# Altium schematic sheet BLE.SchDoc
size A4; CompanyName: SPAN; Engineer: Goverdhan; Organization: University of Utah; Address1: 50 S Central Campus Dr; Address2: MEB Rm 3129; Address3: Salt Lake City, Utah 84115; Address4: USA; Revision: 1; SheetNumber: 3; SheetTotal: 5
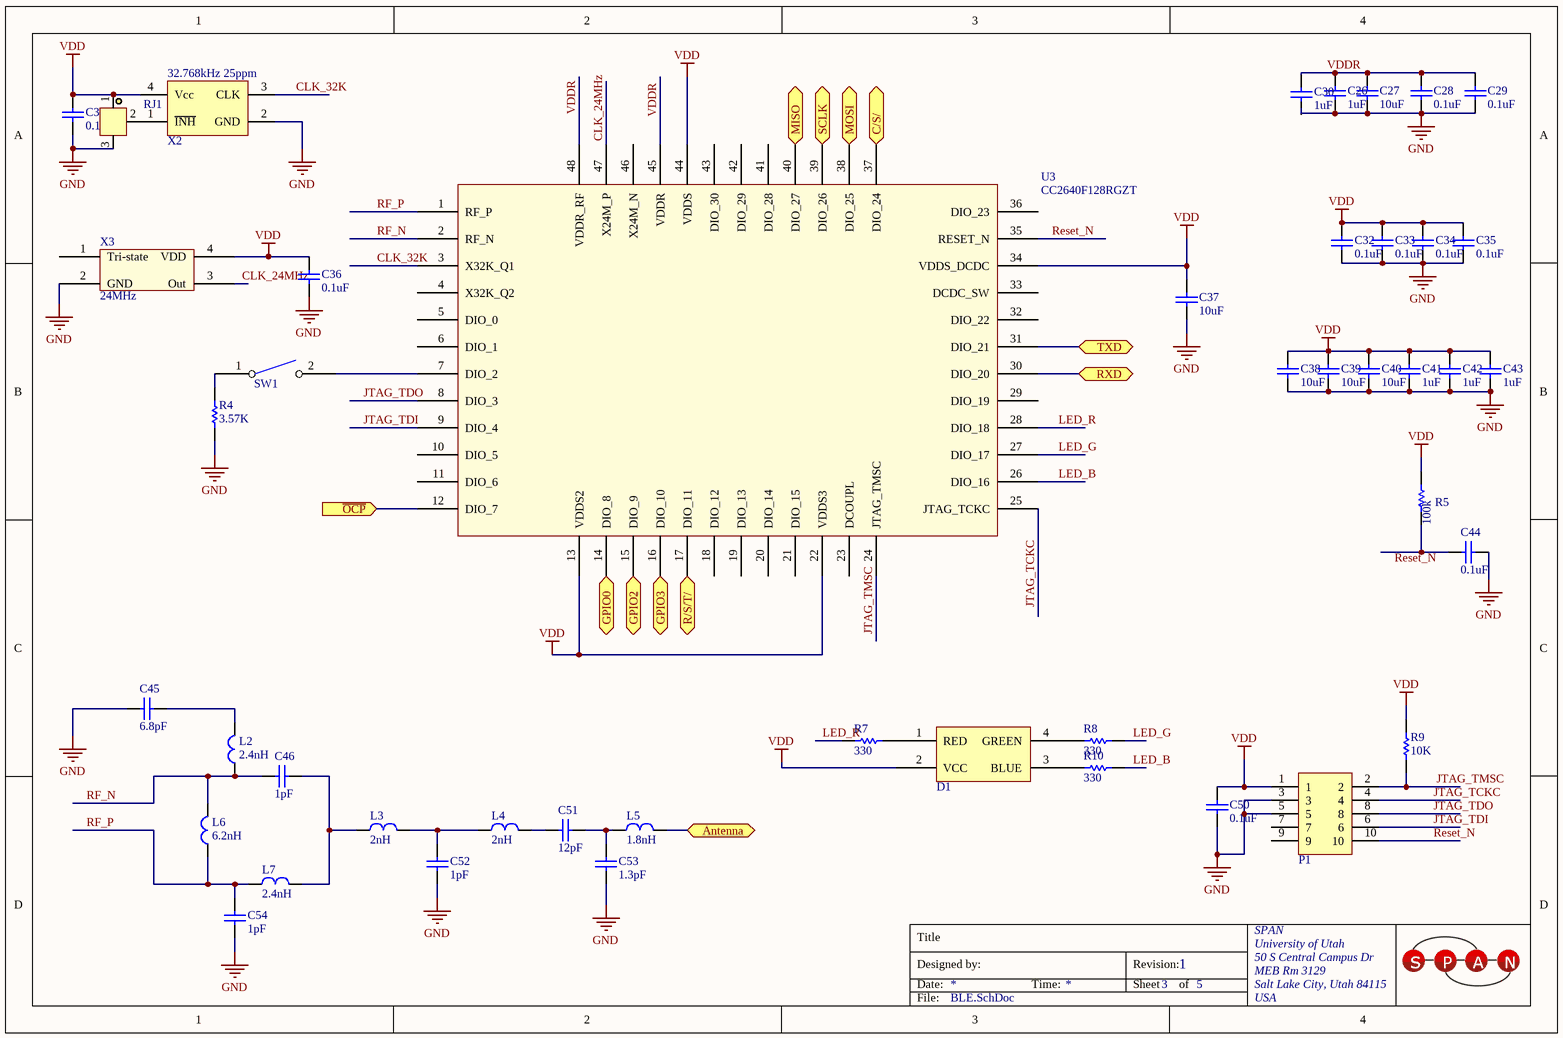
[diagram p0: BLE.SchDoc]

## Parts
C26  1uF  [0603_Cap]
C27  10uF  [0603_Cap]
C28  0.1uF  [0603_Cap]
C29  0.1uF  [0603_Cap]
C30  1uF  [0603_Cap]
C31  0.1uF  [0603_Cap]
C32  0.1uF  [0603_Cap]
C33  0.1uF  [0603_Cap]
C34  0.1uF  [0603_Cap]
C35  0.1uF  [0603_Cap]
C36  0.1uF  [0603_Cap]
C37  10uF  [0603_Cap]
C38  10uF  [0603_Cap]
C39  10uF  [0603_Cap]
C40  10uF  [0603_Cap]
C41  1uF  [0603_Cap]
C42  1uF  [0603_Cap]
C43  1uF  [0603_Cap]
C44  0.1uF  [0603_Cap]
C45  6.8pF  [0603_Cap]
C46  1pF  [0603_Cap]
C50  0.1uF  [0603_Cap]
C51  12pF  [0603_Cap]
C52  1pF  [0603_Cap]
C53  1.3pF  [0603_Cap]
C54  1pF  [0603_Cap]
D1  CLV1A-FKB-CJ1M1F1BB7R4S3  [CREE LV1]  (value not drawn)
L2  2.4nH  [0603_IND]
L3  2nH  [0603_IND]
L4  2nH  [0603_IND]
L5  1.8nH  [0603_IND]
L6  6.2nH  [0603_IND]
L7  2.4nH  [0603_IND]
P1  M50-3500542  [M50]  (value not drawn)
R4  3.57K  [0603_RES]
R5  MCR03ERTJ104  [RESC1608X06N (0603)]  (value not drawn)
R7  330  [0603_RES]
R8  330  [0603_RES]
R9  10K  [0603_RES]
R10  330  [0603_RES]
RJ1  R_J  [RJ]  (value not drawn)
SW1  EVQ-PE105K  [EVQ-PE105K]  (value not drawn)
U3  CC2640F128RGZT  [QFN_48_CC2640]
X2  KC2520B32K7680CM2E00  [2.5x2.0x0.7mmXTAL]  (value not drawn)
X3  24MHz  [XO_24_ASTX_H11]

## Ports
Antenna (bidir), C/S/, GPIO0, GPIO2, GPIO3, MISO, MOSI, R/S/T/, RXD, SCLK, TXD, ~{OCP} (in)

## Nets
GND: C26.1 C27.1 C28.1 C29.1 C31.1 C32.1 C33.1 C34.1 C35.1 C36.1 C37.1 C38.1 C39.1 C40.1 C41.1 C42.1 C43.1 C44.2 C45.1 C50.1 C52.1 C53.1 C54.1 P1.3 P1.5 R4.1 RJ1.3 X2.2(GND) X3.2(GND)
VDD: C31.2 C32.2 C33.2 C34.2 C35.2 C36.2 C37.2 C38.2 C39.2 C40.2 C41.2 C42.2 C43.2 C50.2 D1.2(VCC) P1.1 R5.2 R9.2 RJ1.1 U3.13(VDDS2) U3.22(VDDS3) U3.34(VDDS_DCDC) U3.44(VDDS) X2.4(Vcc) X3.4(VDD)
Antenna: L5.2 ; port Antenna
C/S/: U3.37(DIO_24) ; port C/S/
CLK_24MHz: U3.47(X24M_P) X3.3(Out)
CLK_32K: U3.3(X32K_Q1) X2.3(CLK)
GPIO0: U3.14(DIO_8) ; port GPIO0
GPIO2: U3.15(DIO_9) ; port GPIO2
GPIO3: U3.16(DIO_10) ; port GPIO3
JTAG_TCKC: P1.4 U3.25(JTAG_TCKC)
JTAG_TDI: P1.6 U3.9(DIO_4)
JTAG_TDO: P1.8 U3.8(DIO_3)
JTAG_TMSC: P1.2 R9.1 U3.24(JTAG_TMSC)
LED_B: R10.2 U3.26(DIO_16)
LED_G: R8.2 U3.27(DIO_17)
LED_R: R7.1 U3.28(DIO_18)
MISO: U3.40(DIO_27) ; port MISO
MOSI: U3.38(DIO_25) ; port MOSI
~{OCP}: U3.12(DIO_7) ; port ~{OCP}
R/S/T/: U3.17(DIO_11) ; port R/S/T/
Reset_N: P1.10 U3.35(RESET_N)
RF_N: C46.1 L2.1 L6.2 U3.2(RF_N)
RF_P: C54.2 L6.1 L7.1 U3.1(RF_P)
RXD: U3.30(DIO_20) ; port RXD
SCLK: U3.39(DIO_26) ; port SCLK
TXD: U3.31(DIO_21) ; port TXD
VDDR: C26.2 C27.2 C28.2 C29.2 C30.2 U3.45(VDDR) U3.48(VDDR_RF)
NetC44_1: C44.1 R5.1
NetC45_2: C45.2 L2.2
NetC46_2: C46.2 L3.1 L7.2
NetC51_1: C51.1 L4.2
NetC51_2: C51.2 C53.2 L5.1
NetC52_2: C52.2 L3.2 L4.1
NetD1_1: D1.1(RED) R7.2
NetD1_3: D1.3(BLUE) R10.1
NetD1_4: D1.4(GREEN) R8.1
NetR4_2: R4.2 SW1.1
NetRJ1_2: RJ1.2 X2.1(~{INH})
NetSW1_2: SW1.2 U3.7(DIO_2)

Not connected (* = marked no-connect by the designer): C30 1; P1 7 9; U3 4(X32K_Q2) 5(DIO_0) 6(DIO_1) 10(DIO_5) 11(DIO_6) 18(DIO_12) 19(DIO_13) 20(DIO_14) 21(DIO_15) 23(DCOUPL) 29(DIO_19) 32(DIO_22) 33(DCDC_SW) 36(DIO_23) 41(DIO_28) 42(DIO_29) 43(DIO_30) 46(X24M_N); X3 1(Tri-state)

## Notes on the sheet
- Labels drawn without touching a wire or pin: Reset_N
- Title
- Designed by:
- Date:
- Time:
- Revision:
- Sheet
- of
- File:
- (in symbol KC2520B32K7680CM2E00) 32.768kHz 25ppm

## Library data of the parts
C26 C30 C41-C43 = JMK107C6105KA-T: CAP CER 1uF SMD; Manufacturer: Taiyo Yuden; Capacitance: 1µF; Tolerance: ±10%; Voltage - Rated: 6.3V; Temperature Coefficient: X6S; Supplier 1: Digi-Key; Manufacturer Part Number: JMK107C6105KA-T; RoHS: RoHS Compliant; Category: Capacitors; Stock 1: 8000; Pricing 1: 4000=0.02281, 8000=0.02122, 12000=0.02016, 28000=0.0191, 100000=0.01446 (USD); Packaging: Tape & Reel (TR); Part Status: Active; Operating Temperature: -55°C ~ 105°C; Features: -; Ratings: -; Applications: SMPS Filtering; Failure Rate: -; Mounting Type: Surface Mount, MLCC; Package / Case: 0603 (1608 Metric); Size / Dimension: 0.063" L x 0.031" W (1.60mm x 0.80mm); Height - Seated (Max): -; Thickness (Max): 0.035" (0.90mm); Lead Spacing: -; Lead Style: -; ComponentLink1URL: http://www.yuden.co.jp/productdata/catalog/en/mlcc_all_e.pdf; ComponentLink1Description: http://www.yuden.co.jp/productdata/catalog/en/mlcc_all_e.pdf; Supplier Part Number 1: 587-4904-2-ND
C27 C37-C40 = EMK107BC6106MA-T: CAP CER 10uF; Manufacturer: Taiyo Yuden; Capacitance: 10µF; Tolerance: ±20%; Voltage - Rated: 16V; Temperature Coefficient: X6S; Supplier 1: Digi-Key; Manufacturer Part Number: EMK107BC6106MA-T; RoHS: RoHS Compliant; Category: Capacitors; Stock 1: 0; Pricing 1: 4000=0.08689, 8000=0.08178, 12000=0.07922, 28000=0.07667, 100000=0.06798 (USD); Packaging: Tape & Reel (TR); Part Status: Active; Operating Temperature: -55°C ~ 105°C; Features: -; Ratings: -; Applications: SMPS Filtering; Failure Rate: -; Mounting Type: Surface Mount, MLCC; Package / Case: 0603 (1608 Metric); Size / Dimension: 0.063" L x 0.031" W (1.60mm x 0.80mm); Height - Seated (Max): -; Thickness (Max): 0.039" (1.00mm); Lead Spacing: -; Lead Style: -; ComponentLink1URL: http://www.yuden.co.jp/productdata/catalog/en/mlcc06_e.pdf; ComponentLink1Description: http://www.yuden.co.jp/productdata/catalog/en/mlcc06_e.pdf; Supplier Part Number 1: 587-4867-2-ND
C28 C29 C31-C36 C44 C50 = 0603YC104KAT4A: CAP CER 0.1UF 16V X7R 0603; Manufacturer: AVX Corporation; Capacitance: 0.1µF; Tolerance: ±10%; Supplier 1: Digi-Key; Manufacturer Part Number: 0603YC104KAT4A; RoHS: RoHS Compliant; Category: Capacitors; Stock 1: 15000; Pricing 1: 15000=0.00344, 30000=0.00327, 75000=0.00292, 105000=0.00237 (USD); Packaging: Tape & Reel (TR); Part Status: Active; Voltage - Rated: 16V; Temperature Coefficient: X7R; Operating Temperature: -55°C ~ 125°C; Features: -; Ratings: -; Applications: General Purpose; Failure Rate: -; Mounting Type: Surface Mount, MLCC; Package / Case: 0603 (1608 Metric); Size / Dimension: 0.063" L x 0.032" W (1.60mm x 0.81mm); Height - Seated (Max): -; Thickness (Max): 0.035" (0.90mm); Lead Spacing: -; Lead Style: -; ComponentLink1URL: http://datasheets.avx.com/X7RDielectric.pdf; ComponentLink1Description: http://datasheets.avx.com/X7RDielectric.pdf; Supplier Part Number 1: 478-10054-2-ND
C45 = CL10C6R8CB8NNNC: CAP CER 6.8PF 50V NP0 0603; Manufacturer: Samsung Electro-Mechanics America, Inc.; Tolerance: ±0.25pF; Temperature Coefficient: C0G, NP0; Supplier 1: Digi-Key; Manufacturer Part Number: CL10C6R8CB8NNNC; RoHS: RoHS Compliant; Category: Capacitors; Stock 1: 16000; Pricing 1: 4000=0.00876, 8000=0.008, 12000=0.00762, 28000=0.00724, 100000=0.00524 (USD); Packaging: Tape & Reel (TR); Part Status: Active; Capacitance: 6.8pF; Voltage - Rated: 50V; Operating Temperature: -55°C ~ 125°C; Features: -; Ratings: -; Applications: General Purpose; Mounting Type: Surface Mount, MLCC; Package / Case: 0603 (1608 Metric); Size / Dimension: 0.063" L x 0.031" W (1.60mm x 0.80mm); Height - Seated (Max): -; Thickness (Max): 0.035" (0.90mm); Lead Spacing: -; Lead Style: -; ComponentLink1URL: http://www.samsungsem.com/kr/support/product-search/mlcc/__icsFiles/afieldfile/2016/08/18/S_CL10C6R8CB8NNNC.pdf; ComponentLink1Description: http://www.samsungsem.com/kr/support/product-search/mlcc/__icsFiles/afieldfile/2016/08/18/S_CL10C6R8CB8NNNC.pdf; Supplier Part Number 1: 1276-1793-2-ND
C46 C52 C54 = 251R14S1R0BV4T: CAP CER 1PF 250V NP0 0603; Manufacturer: Johanson Technology Inc.; Tolerance: ±0.1pF; Temperature Coefficient: C0G, NP0; Supplier 1: Digi-Key; Manufacturer Part Number: 251R14S1R0BV4T; RoHS: RoHS Compliant; Category: Capacitors; Stock 1: 92000; Pricing 1: 4000=0.048, 8000=0.0456, 12000=0.0432, 28000=0.0408, 100000=0.0324 (USD); Packaging: Tape & Reel (TR); Part Status: Active; Capacitance: 1pF; Voltage - Rated: 250V; Operating Temperature: -55°C ~ 125°C; Features: High Q, Low Loss; Ratings: -; Applications: RF, Microwave, High Frequency; Mounting Type: Surface Mount, MLCC; Package / Case: 0603 (1608 Metric); Size / Dimension: 0.062" L x 0.032" W (1.57mm x 0.81mm); Height - Seated (Max): -; Thickness (Max): 0.035" (0.89mm); Lead Spacing: -; Lead Style: -; ComponentLink1URL: http://www.johansontechnology.com/downloads/JTI-CAT-MLCC-HighQ.pdf; ComponentLink1Description: http://www.johansontechnology.com/downloads/JTI-CAT-MLCC-HighQ.pdf; Supplier Part Number 1: 712-1323-2-ND
C51 = 251R14S120GV4T: CAP CER 12PF 250V NP0 0603; Manufacturer: Johanson Technology Inc.; Tolerance: ±2%; Temperature Coefficient: C0G, NP0; Supplier 1: Digi-Key; Manufacturer Part Number: 251R14S120GV4T; RoHS: RoHS Compliant; Category: Capacitors; Stock 1: 32000; Pricing 1: 4000=0.1071, 8000=0.1008, 12000=0.09765, 28000=0.0945, 100000=0.0819 (USD); Packaging: Tape & Reel (TR); Part Status: Active; Capacitance: 12pF; Voltage - Rated: 250V; Operating Temperature: -55°C ~ 125°C; Features: High Q, Low Loss; Ratings: -; Applications: RF, Microwave, High Frequency; Mounting Type: Surface Mount, MLCC; Package / Case: 0603 (1608 Metric); Size / Dimension: 0.062" L x 0.032" W (1.57mm x 0.81mm); Height - Seated (Max): -; Thickness (Max): 0.035" (0.89mm); Lead Spacing: -; Lead Style: -; ComponentLink1URL: http://www.johansontechnology.com/downloads/JTI-CAT-MLCC-HighQ.pdf; ComponentLink1Description: http://www.johansontechnology.com/downloads/JTI-CAT-MLCC-HighQ.pdf; Supplier Part Number 1: 712-1313-2-ND
C53 = 251R14S1R3BV4T: CAP CER 1.3PF 250V NP0 0603; Manufacturer: Johanson Technology Inc.; Tolerance: ±0.1pF; Temperature Coefficient: C0G, NP0; Supplier 1: Digi-Key; Manufacturer Part Number: 251R14S1R3BV4T; RoHS: RoHS Compliant; Category: Capacitors; Stock 1: 4000; Pricing 1: 4000=0.048, 8000=0.0456, 12000=0.0432, 28000=0.0408, 100000=0.0324 (USD); Packaging: Tape & Reel (TR); Part Status: Active; Capacitance: 1.3pF; Voltage - Rated: 250V; Operating Temperature: -55°C ~ 125°C; Features: High Q, Low Loss; Ratings: -; Applications: RF, Microwave, High Frequency; Mounting Type: Surface Mount, MLCC; Package / Case: 0603 (1608 Metric); Size / Dimension: 0.062" L x 0.032" W (1.57mm x 0.81mm); Height - Seated (Max): -; Thickness (Max): 0.035" (0.89mm); Lead Spacing: -; Lead Style: -; ComponentLink1URL: http://www.johansontechnology.com/downloads/JTI-CAT-MLCC-HighQ.pdf; ComponentLink1Description: http://www.johansontechnology.com/downloads/JTI-CAT-MLCC-HighQ.pdf; Supplier Part Number 1: 712-1326-2-ND
D1 = CLV1A-FKB-CJ1M1F1BB7R4S3: LED RED/GREEN/BLUE PLCC4 SMD; Manufacturer: Cree Inc; Color: Red, Green, Blue (RGB); Wavelength - Dominant: 621.5nm, 530nm, 472.5nm; Wavelength - Peak: 630nm, 527nm, 470nm; Millicandela Rating: 675mcd Red, 1055mcd Green, 337mcd Blue; Voltage - Forward (Vf) (Typ): 2V Red, 3.2V Green, 3.2V Blue; Current - Test: 20mA; Viewing Angle: 120°; Lens Type: Diffused, White; Lens Style/Size: Round with Flat Top, 2.2mm; Supplier 1: Digi-Key; Manufacturer Part Number: CLV1A-FKB-CJ1M1F1BB7R4S3; RoHS: RoHS Compliant; Category: Optoelectronics; Stock 1: 254000; Pricing 1: 2000=0.354, 50000=0.329, 100000=0.307 (USD); Packaging: Tape & Reel (TR); Package / Case: 4-PLCC; Size / Dimension: 3.20mm L x 2.80mm W; Height: 2.10mm; Mounting Type: Surface Mount; Luminous Flux @ Current - Test: -; ComponentLink1URL: http://www.cree.com/~/media/Files/Cree/LED%20Components%20and%20Modules/HB/Data%20Sheets/CLV1AFKB(874).pdf; ComponentLink1Description: http://www.cree.com/~/media/Files/Cree/LED%20Components%20and%20Modules/HB/Data%20Sheets/CLV1AFKB(874).pdf
L2 L7 = LQW18AN2N4C80D: FIXED IND 2.4NH 2.4A 26 MOHM SMD; Manufacturer: Murata Electronics North America; Type: Wirewound; Material - Core: Non-Magnetic; Tolerance: ±0.2nH; Shielding: Unshielded; DC Resistance (DCR): 26 mOhm Max; Q @ Freq: 18 @ 250MHz; Frequency - Self Resonant: 15GHz; Frequency - Test: 100MHz; Supplier 1: Digi-Key; Manufacturer Part Number: LQW18AN2N4C80D; RoHS: RoHS Compliant; Category: Inductors, Coils, Chokes; Stock 1: 0; Pricing 1: 4000=0.0729, 8000=0.06885, 12000=0.0648, 28000=0.06278, 100000=0.05873 (USD); Packaging: Tape & Reel (TR); Part Status: Active; Inductance: 2.4nH; Current Rating: 2.4A; Current - Saturation: -; Ratings: -; Operating Temperature: -55°C ~ 125°C; Mounting Type: Surface Mount; Package / Case: 0603 (1608 Metric); Supplier Device Package: 0603 (1608 Metric); Size / Dimension: 0.065" L x 0.035" W (1.65mm x 0.90mm); Height - Seated (Max): 0.039" (1.00mm); ComponentLink1URL: http://search.murata.co.jp/Ceramy/image/img/P02/JELF243A-0102.pdf; ComponentLink1Description: http://search.murata.co.jp/Ceramy/image/img/P02/JELF243A-0102.pdf; Supplier Part Number 1: 490-14721-2-ND
L3 L4 = L-14W2N0CV4E: FIXED IND 2NH 700MA 80 MOHM SMD; Manufacturer: Johanson Technology Inc.; Type: Wirewound; Material - Core: Ceramic; Tolerance: ±0.2nH; Shielding: Unshielded; DC Resistance (DCR): 80 mOhm Max; Q @ Freq: 16 @ 250MHz; Frequency - Self Resonant: 6.9GHz; Frequency - Test: 250MHz; Supplier 1: Digi-Key; Manufacturer Part Number: L-14W2N0CV4E; RoHS: RoHS Compliant; Category: Inductors, Coils, Chokes; Stock 1: 0; Pricing 1: 3000=0.0901, 6000=0.0848, 15000=0.08215, 30000=0.0795, 75000=0.07685 (USD); Packaging: Tape & Reel (TR); Part Status: Active; Inductance: 2nH; Current Rating: 700mA; Current - Saturation: -; Ratings: -; Operating Temperature: -40°C ~ 125°C; Mounting Type: Surface Mount; Package / Case: 0603 (1608 Metric); Supplier Device Package: 0603 (1608 Metric); Size / Dimension: 0.063" L x 0.031" W (1.60mm x 0.80mm); Height - Seated (Max): 0.037" (0.94mm); ComponentLink1URL: http://www.johansontechnology.com/downloads/jti-cat-ww-ind.pdf; ComponentLink1Description: http://www.johansontechnology.com/downloads/jti-cat-ww-ind.pdf; Supplier Part Number 1: 712-1618-2-ND
L5 = L-14C1N8SV4T: FIXED IND 1.8NH 300MA 100 MOHM; Manufacturer: Johanson Technology Inc.; Type: Multilayer; Material - Core: Ceramic; Tolerance: ±0.3nH; Shielding: Unshielded; DC Resistance (DCR): 100 mOhm Max; Q @ Freq: 12 @ 100MHz; Frequency - Self Resonant: 23GHz; Frequency - Test: 100MHz; Supplier 1: Digi-Key; Manufacturer Part Number: L-14C1N8SV4T; RoHS: RoHS Compliant; Category: Inductors, Coils, Chokes; Stock 1: 16000; Pricing 1: 4000=0.02142, 8000=0.02023, 12000=0.01904, 28000=0.01845, 100000=0.01726 (USD); Packaging: Tape & Reel (TR); Part Status: Active; Inductance: 1.8nH; Current Rating: 300mA; Current - Saturation: -; Ratings: -; Operating Temperature: -40°C ~ 100°C; Mounting Type: Surface Mount; Package / Case: 0603 (1608 Metric); Supplier Device Package: 0603 (1608 Metric); Size / Dimension: 0.063" L x 0.031" W (1.60mm x 0.80mm); Height - Seated (Max): 0.037" (0.95mm); ComponentLink1URL: http://www.johansontechnology.com/downloads/jti-cat-rf-ind.pdf; ComponentLink1Description: http://www.johansontechnology.com/downloads/jti-cat-rf-ind.pdf; Supplier Part Number 1: 712-1426-2-ND
L6 = LQP15MN6N2B02D: FIXED IND 6.2NH 130MA 900 MOHM; Manufacturer: Murata Electronics North America; Type: Thin Film; Material - Core: Non-Magnetic; Tolerance: ±0.1nH; Shielding: Unshielded; DC Resistance (DCR): 900 mOhm Max; Q @ Freq: 13 @ 500MHz; Frequency - Self Resonant: 6GHz; Frequency - Test: 500MHz; Supplier 1: Digi-Key; Manufacturer Part Number: LQP15MN6N2B02D; RoHS: RoHS Compliant; Category: Inductors, Coils, Chokes; Stock 1: 20000; Pricing 1: 10000=0.05344, 30000=0.05177, 50000=0.0501, 100000=0.04843 (USD); Packaging: Tape & Reel (TR); Part Status: Active; Inductance: 6.2nH; Current Rating: 130mA; Current - Saturation: -; Ratings: -; Operating Temperature: -40°C ~ 85°C; Mounting Type: Surface Mount; Package / Case: 0402 (1005 Metric); Supplier Device Package: 0402 (1005 Metric); Size / Dimension: 0.039" L x 0.020" W (1.00mm x 0.50mm); Height - Seated (Max): 0.018" (0.45mm); ComponentLink1URL: http://search.murata.co.jp/Ceramy/image/img/PDF/ENG/L0075S0084LQP15M.pdf; ComponentLink1Description: http://search.murata.co.jp/Ceramy/image/img/PDF/ENG/L0075S0084LQP15M.pdf; Supplier Part Number 1: 490-6759-2-ND
P1 = M50-3500542: CONN HDR 1.27MM VERT AU 10POS; Manufacturer: Harwin Inc; Connector Type: Unshrouded; Number of Positions: 10; Number of Positions Loaded: All; Pitch: 0.050" (1.27mm); Molding Height Above Board: 0.039" (1.00mm); Supplier 1: Digi-Key; Manufacturer Part Number: M50-3500542; RoHS: RoHS Compliant; Category: Connectors, Interconnects; Stock 1: 16006; Pricing 1: 1=1.16, 10=1.017, 25=0.9576, 50=0.9178, 100=0.8778, 250=0.798, 500=0.7182, 1000=0.6384, 2500=0.57855 (USD); Packaging: Bulk; Number of Rows: 2; Row Spacing: 0.050" (1.27mm); Height Stacking (Mating): -; Contact Mating Length: 0.118" (3.00mm); Mounting Type: Through Hole; Termination: Solder; Contact Finish: Gold; Contact Finish Thickness: 5.9µin (0.15µm); Features: -; Color: Black; ComponentLink1URL: http://harwin.com/includes/pdfs/M50-350.pdf; ComponentLink1Description: http://harwin.com/includes/pdfs/M50-350.pdf
R4 = TNPW06033K57BEEA: RES SMD 3.57KOHM 0.1% 1/10W 0603; Manufacturer: Vishay Dale; Power (Watts): 0.1W, 1/10W; Temperature Coefficient: ±25ppm/°C; Supplier 1: Digi-Key; Manufacturer Part Number: TNPW06033K57BEEA; RoHS: RoHS Compliant; Category: Resistors; Stock 1: 0; Pricing 1: 5000=0.1064 (USD); Packaging: Tape & Reel (TR); Part Status: Active; Resistance (Ohms): 3.57k; Tolerance: ±0.1%; Composition: Thin Film; Features: Anti-Sulfur, Automotive AEC-Q200, Moisture Resistant; Operating Temperature: -55°C ~ 125°C; Package / Case: 0603 (1608 Metric); Supplier Device Package: 0603; Size / Dimension: 0.063" L x 0.033" W (1.60mm x 0.85mm); Height - Seated (Max): 0.022" (0.55mm); Number of Terminations: 2; Failure Rate: -; ComponentLink1URL: http://www.vishay.com/docs/28758/tnpw_e3.pdf; ComponentLink1Description: http://www.vishay.com/docs/28758/tnpw_e3.pdf; Supplier Part Number 1: TNPW06033K57BEEA-ND
R5 = MCR03ERTJ104: RES 100K OHM 1/10W 5% 0603 SMD; Manufacturer: Rohm Semiconductor; Power (Watts): 0.1W, 1/10W; Temperature Coefficient: ±200ppm/°C; Supplier 1: Digi-Key; Manufacturer Part Number: MCR03ERTJ104; RoHS: RoHS Compliant; Category: Resistors; Stock 1: 70000; Pricing 1: 5000=0.00122, 10000=0.00106, 25000=0.00093, 50000=0.00085, 125000=0.00083 (USD); Packaging: Tape & Reel (TR); Resistance (Ohms): 100k; Tolerance: ±5%; Composition: Thick Film; Features: -; Operating Temperature: -55°C ~ 155°C; Package / Case: 0603 (1608 Metric); Supplier Device Package: 0603 (1608 Metric); Size / Dimension: 0.063" L x 0.031" W (1.60mm x 0.80mm); Height: 0.022" (0.55mm); Number of Terminations: 2; ComponentLink1URL: http://rohmfs.rohm.com/en/products/databook/datasheet/passive/resistor/chip_resistor/mcr_g.pdf; ComponentLink1Description: http://rohmfs.rohm.com/en/products/databook/datasheet/passive/resistor/chip_resistor/mcr_g.pdf
R7 R8 R10 = RC0603JR-07330RL: RES SMD 330 OHM 5% 1/10W 0603; Manufacturer: Yageo; Power (Watts): 0.1W, 1/10W; Temperature Coefficient: ±100ppm/°C; Supplier 1: Digi-Key; Manufacturer Part Number: RC0603JR-07330RL; RoHS: RoHS Compliant; Category: Resistors; Stock 1: 1380000; Pricing 1: 5000=0.00129, 10000=0.00112, 25000=0.00099, 50000=0.0009, 125000=0.00089 (USD); Packaging: Tape & Reel (TR); Part Status: Active; Resistance (Ohms): 330; Tolerance: ±5%; Composition: Thick Film; Features: Moisture Resistant; Operating Temperature: -55°C ~ 155°C; Package / Case: 0603 (1608 Metric); Supplier Device Package: 0603; Size / Dimension: 0.063" L x 0.031" W (1.60mm x 0.80mm); Height - Seated (Max): 0.022" (0.55mm); Number of Terminations: 2; Failure Rate: -; ComponentLink1URL: http://www.yageo.com/documents/recent/PYu-RC_Group_51_RoHS_L_6.pdf; ComponentLink1Description: http://www.yageo.com/documents/recent/PYu-RC_Group_51_RoHS_L_6.pdf; Supplier Part Number 1: 311-330GRTR-ND
R9 = PHT0603Y1002BGT200: RES SMD 10KOHM 0.1% 0.0375W 0603; Manufacturer: Vishay Sfernice; Temperature Coefficient: ±15ppm/°C; Supplier 1: Digi-Key; Manufacturer Part Number: PHT0603Y1002BGT200; RoHS: RoHS Compliant; Category: Resistors; Stock 1: 400; Pricing 1: 200=6.6496, 400=6.0262, 600=5.6106, 1000=5.195 (USD); Packaging: Tape & Reel (TR); Part Status: Active; Resistance (Ohms): 10k; Tolerance: ±0.1%; Power (Watts): 0.0375W; Composition: Thin Film; Features: Anti-Sulfur; Operating Temperature: -55°C ~ 215°C; Package / Case: 0603 (1608 Metric); Supplier Device Package: 0603; Size / Dimension: 0.060" L x 0.033" W (1.52mm x 0.85mm); Height - Seated (Max): 0.025" (0.64mm); Number of Terminations: 2; Failure Rate: -; ComponentLink1URL: http://www.vishay.com/docs/53050/pht.pdf; ComponentLink1Description: http://www.vishay.com/docs/53050/pht.pdf; Supplier Part Number 1: PHTB-10KTR-ND
RJ1 = R_J: Resistor Jumper; Value: DNP; Mounting Type: Surface Mount, MLCC; Applications: General Purpose; Package / Case: 0603 (1608 Metric)
SW1 = EVQ-PE105K: SWITCH TACTILE SPST-NO 0.05A 12V; Manufacturer: Panasonic Electronic Components; Switch Function: Off-Mom; Contact Rating @ Voltage: 0.05A @ 12VDC; Actuator Type: Standard; Actuator Height off PCB, from Pins: 5.00mm; Actuator Orientation: Top Actuated; Outline: 6.00mm x 3.50mm; Illumination: Non-Illuminated; Operating Force: 100gf; Switch Travel: 0.25mm; Mechanical Life: 50,000 Cycles; Supplier 1: Digi-Key; Manufacturer Part Number: EVQ-PE105K; RoHS: RoHS Compliant; Category: Switches; Stock 1: 18000; Pricing 1: 2000=0.32832, 4000=0.3078, 6000=0.29754, 10000=0.27702, 14000=0.27292, 50000=0.26676 (USD); Packaging: Tape & Reel (TR); Circuit: SPST-NO; Mounting Type: Surface Mount; Termination Style: Gull Wing; Illumination Voltage (Nominal): -; Illumination Type, Color: -; Ingress Protection: -; Features: -; Actuator Material: -; Operating Temperature: -30°C ~ 85°C; ComponentLink1URL: http://www.panasonic.com/industrial/components/pdf/ATK0000CE7.pdf; ComponentLink1Description: http://www.panasonic.com/industrial/components/pdf/ATK0000CE7.pdf
U3 = CC2640F128RGZT: IC RF TXRX+MCU BLUETOOTH 48VFQFN; Manufacturer: Texas Instruments; Protocol: Bluetooth v4.1; Modulation: DSSS, O-QPSK, GFSK; Frequency: 2.4GHz; Data Rate (Max): 1Mbps; Power - Output: 5dBm; Sensitivity: -97dBm; Memory Size: 128kB Flash, 28kB SRAM; Serial Interfaces: I²C, I²S, JTAG, SPI, UART; GPIO: 31; Voltage - Supply: 1.8 V ~ 3.8 V; Current - Receiving: 5.9mA ~ 6.1mA; Current - Transmitting: 6.1mA ~ 9.1mA; Supplier 1: Digi-Key; RoHS: RoHS Compliant; Category: RF/IF and RFID; Stock 1: 5250; Pricing 1: 250=3.99416, 500=3.58394, 750=3.23851, 1250=3.0226 (USD); Packaging: Tape & Reel (TR); Part Status: Active; Type: TxRx + MCU; RF Family/Standard: Bluetooth; Operating Temperature: -40°C ~ 85°C; Package / Case: 48-VFQFN Exposed Pad; ComponentLink1URL: http://www.ti.com/lit/ds/symlink/cc2640.pdf; ComponentLink1Description: http://www.ti.com/lit/ds/symlink/cc2640.pdf; Supplier Part Number 1: 296-39655-2-ND; Manufacturer Part Number: CC2640F128RGZT
X2 = KC2520B32K7680CM2E00: OSC XO 32.768KHZ CMOS SMD; Manufacturer: AVX Corp/Kyocera Corp; Function: Standby (Power Down); Voltage - Supply: 1.6 V ~ 5.5 V; Frequency Stability: ±25ppm; Current - Supply (Max): 140µA; Current - Supply (Disable) (Max): 10µA; Supplier 1: Digi-Key; Manufacturer Part Number: KC2520B32K7680CM2E00; RoHS: RoHS Compliant; Category: Crystals and Oscillators; Stock 1: 2000; Pricing 1: 2000=1.18, 4000=1.12, 6000=1.08, 10000=1.04 (USD); Packaging: Tape & Reel (TR); Type: XO (Standard); Frequency: 32.768kHz; Output: CMOS; Operating Temperature: -40°C ~ 85°C; Ratings: -; Mounting Type: Surface Mount; Size / Dimension: 0.098" L x 0.079" W (2.50mm x 2.00mm); Height: 0.028" (0.70mm); Package / Case: 4-SMD, No Lead (DFN, LCC); ComponentLink1URL: http://www.kyocera-crystal.jp/eng/wp-content/uploads/2014/09/kc2520b_e.pdf; ComponentLink1Description: http://www.kyocera-crystal.jp/eng/wp-content/uploads/2014/09/kc2520b_e.pdf
X3 = ASTX-H11-24.000MHZ-I25-T: OSC TCXO 24.000MHZ HCMOS SMD; Manufacturer: Abracon LLC; Function: Enable/Disable; Voltage - Supply: 3.3V; Frequency Stability: ±2.5ppm; Current - Supply (Max): 5.5mA; Supplier 1: Digi-Key; Manufacturer Part Number: ASTX-H11-24.000MHZ-I25-T; RoHS: RoHS Compliant; Category: Crystals, Oscillators, Resonators; Stock 1: 0; Pricing 1: 1000=2.52 (USD); Packaging: Tape & Reel (TR); Part Status: Active; Type: TCXO; Frequency: 24MHz; Output: HCMOS; Operating Temperature: -40°C ~ 85°C; Ratings: -; Mounting Type: Surface Mount; Package / Case: 4-SMD, No Lead; Size / Dimension: 0.126" L x 0.098" W (3.20mm x 2.50mm); Height - Seated (Max): 0.043" (1.10mm); Current - Supply (Disable) (Max): -; ComponentLink1URL: http://www.abracon.com/Oscillators/ASTX-H11.pdf; ComponentLink1Description: http://www.abracon.com/Oscillators/ASTX-H11.pdf; Supplier Part Number 1: ASTX-H11-24.000MHZ-I25-T-ND